# Altium schematic sheet ESP32-HWE-Dev-SPI.SchDoc
size A4; SheetNumber: 2; SheetTotal: 4
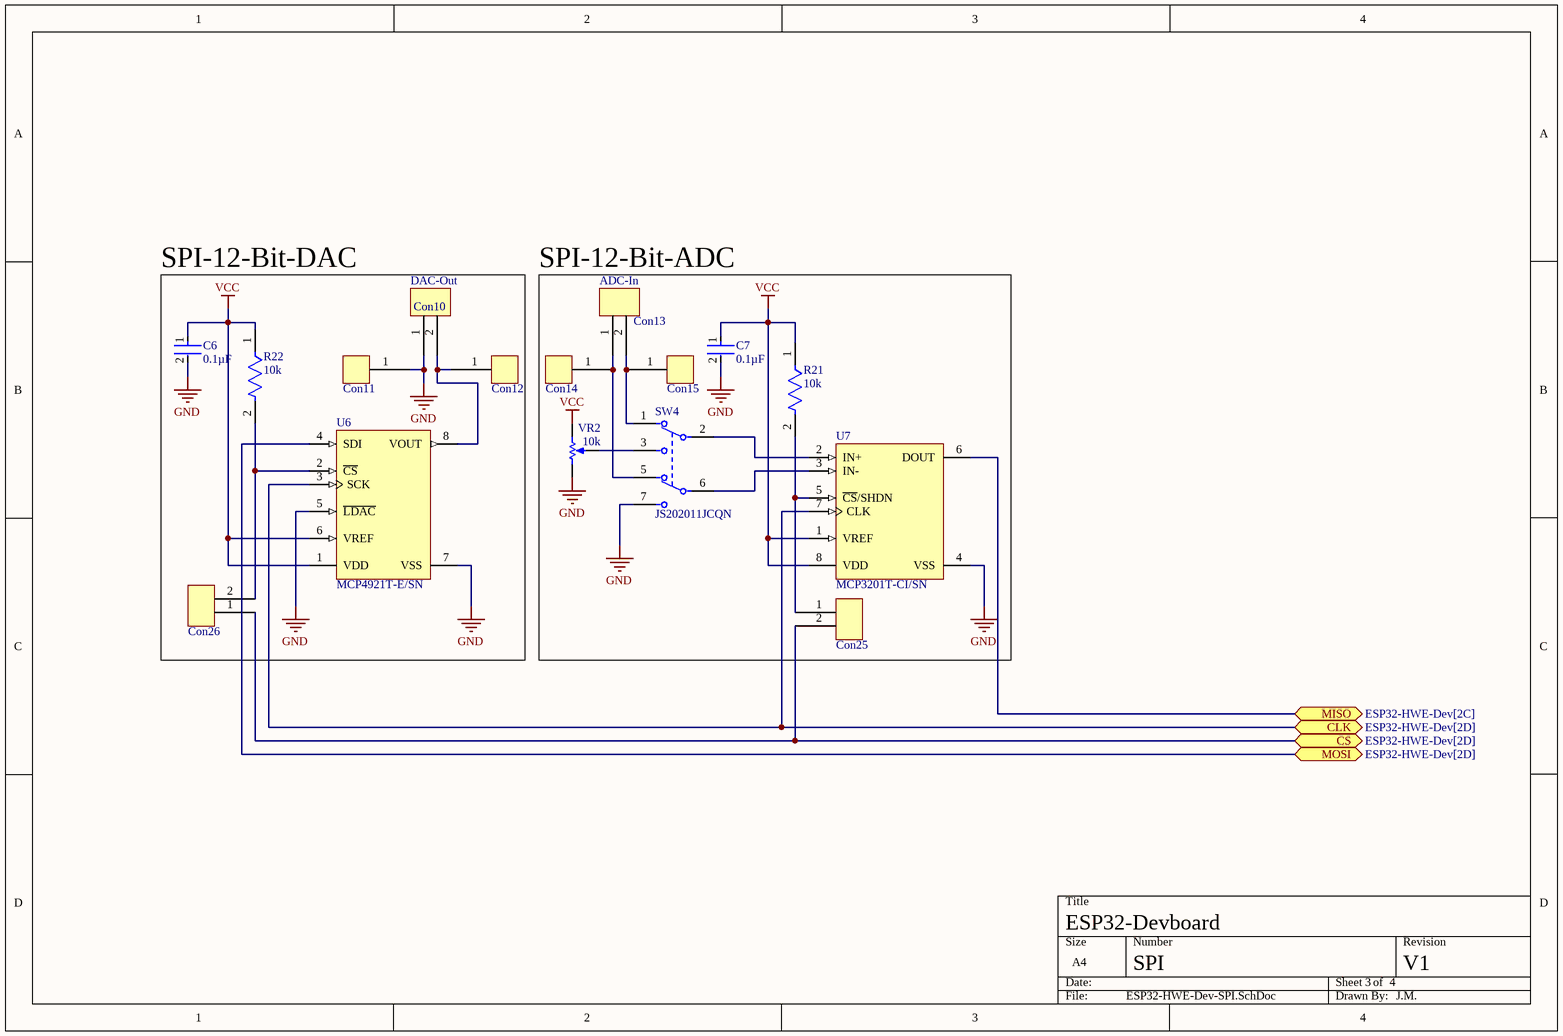
[diagram p0: ESP32-HWE-Dev-SPI.SchDoc]

## Parts
C6  0.1µF  [FP-0805-L_2_01_0_2-W_1_25-IPC_C]
C7  0.1µF  [FP-0805-L_2_01_0_2-W_1_25-IPC_C]
Con10  DAC-Out  [Header_Female_2Pin]
Con11  Solder Nail RTM 1.3  [Solder_Nail_RTM_1.3]  (value not drawn)
Con12  Solder Nail RTM 1.3  [Solder_Nail_RTM_1.3]  (value not drawn)
Con13  ADC-In  [Header_Female_2Pin]
Con14  Solder Nail RTM 1.3  [Solder_Nail_RTM_1.3]  (value not drawn)
Con15  Solder Nail RTM 1.3  [Solder_Nail_RTM_1.3]  (value not drawn)
Con25  Male 2 Pin  [Header_Male_2Pin]  (value not drawn)
Con26  Male 2 Pin  [Header_Male_2Pin]  (value not drawn)
R21  10k  [FP-AC0805-MFG]
R22  10k  [FP-AC0805-MFG]
SW4  JS202011JCQN  [FP-JS202011JCQN-MFG]
U6  MCP4921T-E/SN  [SOIC-SN8_L]
U7  MCP3201T-CI/SN  [SOIC-SN8_M]
VR2  10k  [BOUR-3362P]

## Blocks framed on the sheet
SPI-12-Bit-DAC: C6 Con10-Con12 Con26 R22 U6
SPI-12-Bit-ADC: C7 Con13-Con15 Con25 R21 SW4 U7 VR2

## Ports
CLK (bidir, see ESP32-HWE-Dev[2D]), CS (bidir, see ESP32-HWE-Dev[2D]), MISO (bidir, see ESP32-HWE-Dev[2C]), MOSI (bidir, see ESP32-HWE-Dev[2D])

## Nets
GND: C6.2 C7.2 Con10.1 Con11.1 SW4.7 U6.5(~{LDAC}) U6.7(VSS) U7.4(VSS) VR2.1(CCW)
VCC: C6.1 C7.1 R21.1 R22.1 U6.1(VDD) U6.6(VREF) U7.1(VREF) U7.8(VDD) VR2.3(CW)
CLK: U6.3(SCK) U7.7(CLK) ; port CLK
CS: Con25.2 Con26.1 ; port CS
MISO: U7.6(DOUT) ; port MISO
MOSI: U6.4(SDI) ; port MOSI
NetCon10_2: Con10.2 Con12.1 U6.8(VOUT)
NetCon13_1: Con13.1 Con14.1 SW4.5
NetCon13_2: Con13.2 Con15.1 SW4.1
NetCon25_1: Con25.1 R21.2 U7.5(~{CS}/SHDN)
NetCon26_2: Con26.2 R22.2 U6.2(~{CS})
NetSW4_2: SW4.2(1_C) U7.2(IN+)
NetSW4_3: SW4.3 VR2.2(S)
NetSW4_6: SW4.6(2_C) U7.3(IN-)

## Notes on the sheet
- ESP32-Devboard
- SPI
- 3
- 4
- V1
- J.M.

## Library data of the parts
C6 C7 = CMP-2000-05016-2: General Purpose Ceramic Capacitor, 0805, 100nF, 10%, X7R, 0.15, 50V; Dissipation Factor: 2.5%; Insulation Resistance: 100GR; Voltage Rating (DC): 50V; Package Quantity: 4000; Tolerance: 10%; Voltage Rating: 50V; Dielectric: X7R; Case/Package: 0805; Lead Free: Lead Free; Dielectric Material: Ceramic; Thickness: 0.037inch; Weight: 0.001411oz; Max Operating Temperature: 125°C; REACH SVHC: No SVHC; Mount: Surface Mount; RoHS Compliant: Yes; Depth: 1.25mm; Height: 0.5mm; Case Code (Metric): 2012; Length: 2mm; Termination: Standard; Case Code (Imperial): 0805; Number of Pins: 2; Voltage: 50V; Radiation Hardening: No; Min Operating Temperature: -55°C; Capacitance: 100nF; Width: 1.2mm; Series: MLCC X7R; Packaging: Cut Tape
Con10 Con13 = Header_Female_2Pin
Con11 Con12 Con14 Con15 = Solder_Nail_RTM_1.3
Con25 Con26 = Header_Male_2Pin
R21 R22 = CMP-2001-04476-2: RES SMD 4.7K OHM 5% 1/8W 0805; Manufacturer: Yageo; Manufacturer Part Number: AC0805JR-074K7L; Tolerance: 0.05; Value: 4.7KΩ; Voltage Rating: 150V; Automotive Grade: Grade 0; ComponentLink2URL: http://www.yageo.com/documents/recent/PYu-AC_51_RoHS_L_6.pdf; Power Rating: 1/8W; Package: AC0805; Mouser Description: Thick Film Resistors - SMD 1/8W 4.7K ohm 5% AEC-Q200; Height: 0.6mm; Device Class L2: Resistors; ComponentLink2Description: Datasheet; Series: AC; RoHS: TRUE; Resistance: 4.7KΩ; Digikey Description: RES SMD 4.7K OHM 5% 1/8W 0805; Lead Free: Yes; Category: Res; Temperature Range Low: -55°C; Temperature Range High: +155°C; Composition: Thick Film; Device Class L3: Chip SMD Resistors; Device Class L1: Passive Components; Automotive: Yes; Octopart: https://octopart.com/ac0805jr-074k7l-yageo-26638632; Temperature: -55°C to +155°C; Ipc Land Pattern Name: RESC200125X50; Footprint Url: http://www.yageo.com/exep/pages/download/literatures/PYu-R_Mount_10.pdf
SW4 = CMP-10038-000009-1: SWITCH SLIDE DPDT 300MA 6V; Actuator Material: Nylon; Actuator Length: 2mm; Actuator Type: Standard; Electrical Life: 5000Cycles; Switch Function: On-On; Mount: Surface Mount; Current Rating: 300mA; Contact Material: Copper Alloy; Voltage Rating (DC): 6V; Throw Configuration: DPDT; Packaging: Cut Tape; Contact Plating: Silver; Min Operating Temperature: -40°C; Switch Travel: 2mm; Max Operating Temperature: 85°C
U6 = CMP-0188-00494-2: 12-Bit DAC with SPI Interface, 8-Pin SOIC 150mil, Extended Temperature, Tape and Reel; DatasheetVersion: revA, Apr-2010; RevisionNote: URLs added. DatasheetVersion updated. Sch updated.; ComponentLink2Description: Datasheet; ComponentLink3Description: Package Specification; ComponentLink1Description: Manufacturer URL; ComponentLink2URL: http://ww1.microchip.com/downloads/en/DeviceDoc/22248a.pdf; PackageDescription: 8-Lead Plastic Small Outline (SN) - Narrow, 3.90mm Body [SOIC]; PackageVersion: revBB, Aug-2009; Code_JEDEC: MS-012; Code_IPC: SOIC127P600-8; ComponentLink1URL: http://www.microchip.com/; PackageReference: SOIC-SN8; ComponentLink3URL: http://www.microchip.com/stellent/groups/techpub_sg/documents/packagingspec/en012702.pdf
U7 = CMP-0188-00467-2: 2.7V 12-Bit A/D Converter with SPI Serial Interface, 8-Pin SOIC 150mil, C Performance Grade, Industrial Temperature, Tape and Reel; RevisionNote: URLs added. DatasheetVersion updated.; PackageVersion: revBB, Aug-2009; ComponentLink2URL: http://ww1.microchip.com/downloads/en/DeviceDoc/21290F.pdf; DatasheetVersion: revF, Aug-2011; ComponentLink1URL: http://www.microchip.com/; Code_IPC: SOIC127P600-8; ComponentLink1Description: Manufacturer URL; ComponentLink3Description: Package Specification; PackageReference: SOIC-SN8; ComponentLink3URL: http://www.microchip.com/stellent/groups/techpub_sg/documents/packagingspec/en012702.pdf; PackageDescription: 8-Lead Plastic Small Outline (SN) - Narrow, 3.90mm Body [SOIC]; Code_JEDEC: MS-012; ComponentLink2Description: Datasheet
VR2 = CMP-1747-00004-1: Square Trimpot(R) Trimming Potentiometer, 10 KOhm, 300 V, -55 to 125 degC, 3-Pin THD, RoHS, Tube; Voltage Rating: 220 mV; Power Rating: 1 W; Tolerance: 1%; Resistance: 50 mohm; Case/Package: 1206; Length: 3.2 mm; RoHSCompliant: True; PackageDescription: 3-Pin Through Hole Device, Body 6.6 x 6.99 mm, Pitch 2.54 mm; ComponentLink2Description: Datasheet; REACH SVHC: No SVHC; Mount: Surface Mount; Height: 0.6 mm; Packaging: Tape and Reel; ComponentLink1URL: http://www.bourns.com/; Case Code (Imperial): 0612; Pins: 2; Case Code (Metric): 1632; ComponentLink2URL: http://www.bourns.com/docs/Product-Datasheets/3362.pdf; Min Operating Temperature: -25degC; ComponentLink1Description: Manufacturer URL; PackageReference: 3326P; Max Operating Temperature: 125degC; Width: 1.6 mm; Package Quantity: 5000; DatasheetVersion: May-16